# Altium schematic sheet CAN.SchDoc
size A4; SheetNumber: 13; SheetTotal: 13
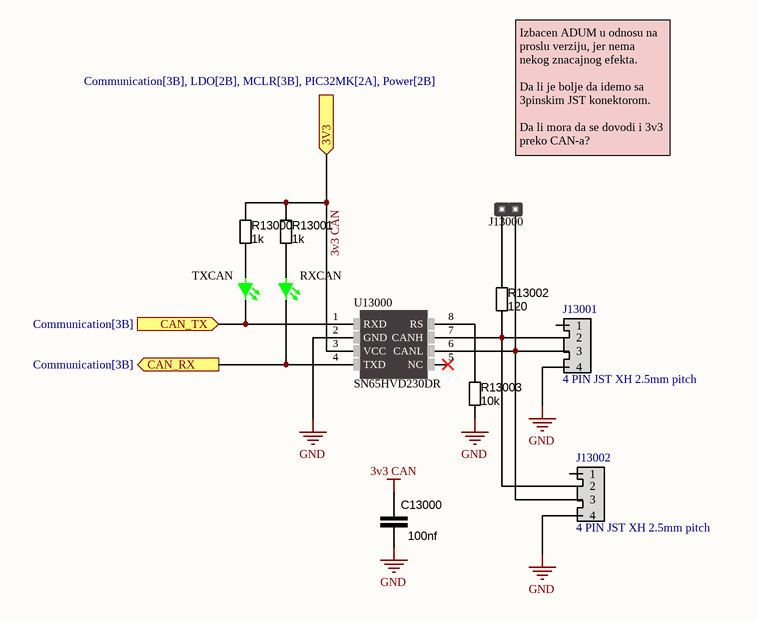
[diagram p0: CAN.SchDoc]

## Parts
C13000  100nf  [CAP_0603]
J13000  *  [HM1x2]  (value not drawn)
J13001  4 PIN JST XH 2.5mm pitch  [JST4PIN]
J13002  4 PIN JST XH 2.5mm pitch  [JST4PIN]
R13000  1k  [RES_0603]
R13001  1k  [RES_0603]
R13002  120  [RES_0603]
R13003  10k  [RES_0603]
RXCAN  GREEN LED  [DIOC1608X04N]  (value not drawn)
TXCAN  GREEN LED  [DIOC1608X04N]  (value not drawn)
U13000  SN65HVD230DR  [SOIC-8]

## Ports
3V3 (in, see Communication[3B], LDO[2B], MCLR[3B], PIC32MK[2A], Power[2B]), CAN_RX (out, see Communication[3B]), CAN_TX (in, see Communication[3B])

## Nets
3v3 CAN: C13000.2 R13000.2 R13001.2 U13000.3(VCC) ; port 3V3
GND: C13000.1 J13001.4 J13002.4 R13003.1 U13000.2(GND)
CAN_RX: RXCAN.2 U13000.4(TXD) ; port CAN_RX
CAN_TX: TXCAN.2 U13000.1(RXD) ; port CAN_TX
NetJ13000_1: J13000.1 R13002.2
NetJ13000_2: J13000.2 J13001.3 J13002.3 U13000.6(CANL)
NetJ13001_2: J13001.2 J13002.2 R13002.1 U13000.7(CANH)
NetR13000_1: R13000.1 TXCAN.1
NetR13001_1: R13001.1 RXCAN.1
NetR13003_2: R13003.2 U13000.8(RS)

Not connected (* = marked no-connect by the designer): J13001 1; J13002 1; U13000 5(NC)*

## Notes on the sheet
- Izbacen ADUM u odnosu na proslu verziju, jer nema nekog znacajnog efekta.
  Da li je bolje da idemo sa 3pinskim JST konektorom.
  Da li mora da se dovodi i 3v3 preko CAN-a?

## Library data of the parts
C13000 = C000007: CAP CER 100nF 0603 25V X7R; capaticanse: 100nf; ComponentLink1Description: digikey; ComponentLink1URL: https://www.digikey.com/en/products/detail/kyocera-avx/06033C104K4T2A/8019250
J13000 = HEADER_1x2: Manufacturer Part Number: *
J13001 J13002 = JST4PIN
R13000 R13001 = R000004: RES 1k OHM 1% 1/10W 0603; resistance: 1Kohm; ComponentLink1Description: digikey; ComponentLink1URL: https://www.digikey.com/en/products/detail/vishay-beyschlag-draloric-bc-components/MCT06030C1001FP500/2607821
R13002 = R000004: RES 120 OHM 1% 1/10W 0603; resistance: 1Kohm; ComponentLink1Description: digikey; ComponentLink1URL: https://www.digikey.com/en/products/detail/vishay-beyschlag-draloric-bc-components/MCT06030C1001FP500/2607821
R13003 = R000004: RES 10k OHM 1% 1/10W 0603; resistance: 1Kohm; ComponentLink1Description: digikey; ComponentLink1URL: https://www.digikey.com/en/products/detail/vishay-beyschlag-draloric-bc-components/MCT06030C1001FP500/2607821
RXCAN TXCAN = 00000001: LED GREEN DIFFUSED 0603 SMD; Supplier 1: Avnet; Supplier Part Number 1: Q65111A3964; ComponentLink1Description: Digikey; ComponentLink1URL: https://www.digikey.com/en/products/detail/ams-osram-usa-inc/LG-Q396-PS-35/5249855
U13000 = SN65HVD230: IC EMC CAN TRANSCEIVER 8-SOIC; Assembly: SMD; Barcode: 00000001; Manufacturer Part Number: SN65HVD230DR; Comet Product Page: http://store.comet.rs/Catalogue/Product/9057/; Datasheet Link: http://www.ti.com/lit/ds/symlink/sn65hvd232.pdf; Category: Integrated Circuits (ICs); Package: SOIC-8; Family: Comunication